# Altium schematic sheet CH240128.SchDoc
size A4; Organization: Altium Limited; Address1: L3, 12a Rodborough Rd; Address2: Frenchs Forest; Address3: NSW; Address4: Australia 2086
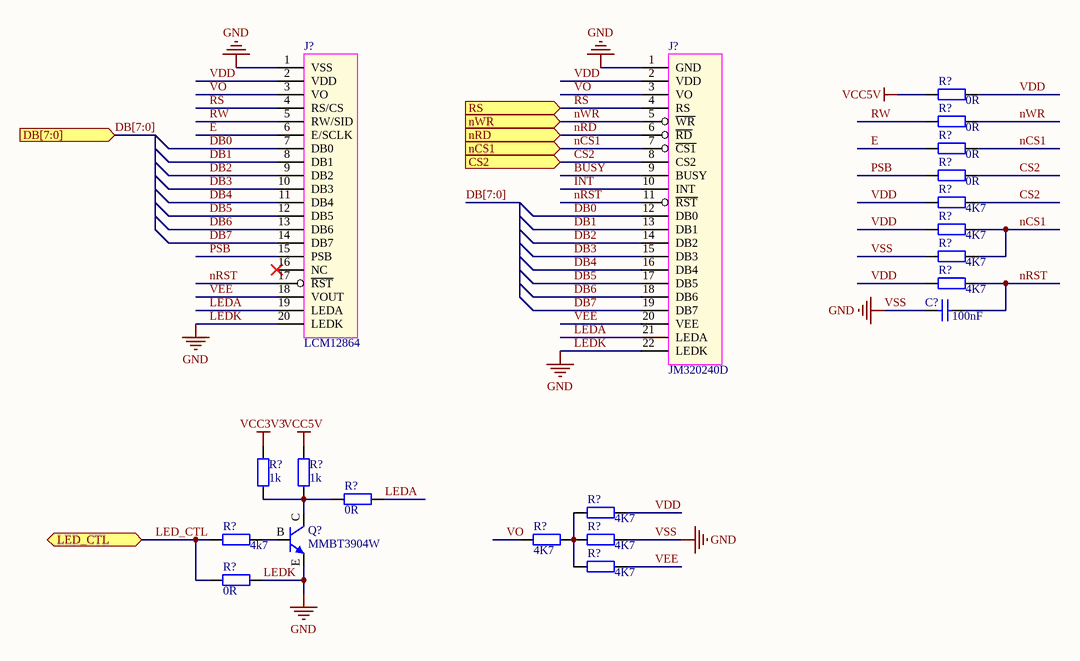
[diagram p0: CH240128.SchDoc]

## Parts
(Parts that share a designator on the sheet are numbered #1, #2 ... from top to bottom, then left to right.)
C?  value 100nF  [R0402]  (hidden comment: CAP_04)
J?#1  LCM12864
J?#2  JM320240D
Q?  MMBT3904W  [SOT_23]
R?#1  value 0R  [R0402]  (hidden comment: RES_04)
R?#2  value 0R  [R0402]  (hidden comment: RES_04)
R?#3  value 0R  [R0402]  (hidden comment: RES_04)
R?#4  value 0R  [R0402]  (hidden comment: RES_04)
R?#5  value 4K7  [R0402]  (hidden comment: RES_04)
R?#6  value 4K7  [R0402]  (hidden comment: RES_04)
R?#7  value 4K7  [R0402]  (hidden comment: RES_04)
R?#8  value 4K7  [R0402]  (hidden comment: RES_04)
R?#9  value 1k  [R0402]  (hidden comment: RES_04)
R?#10  value 1k  [R0402]  (hidden comment: RES_04)
R?#11  value 0R  [R0402]  (hidden comment: RES_04)
R?#12  value 4K7  [R0402]  (hidden comment: RES_04)
R?#13  value 4k7  [R0402]  (hidden comment: RES_04)
R?#14  value 4K7  [R0402]  (hidden comment: RES_04)
R?#15  value 4K7  [R0402]  (hidden comment: RES_04)
R?#16  value 4K7  [R0402]  (hidden comment: RES_04)
R?#17  value 0R  [R0402]  (hidden comment: RES_04)

## Ports
CS2 (in), DB[7:0] (in), LED_CTL, nCS1 (in), nRD (in), nWR (in), RS (in)

## Nets
LEDK: C?.1 J?#1.1(VSS) J?#1.20(LEDK) J?#2.1(GND) J?#2.22(LEDK) Q?.E R?#7.1 R?#15.2 R?#17.2  [also labelled GND, VSS]
VCC3V3: R?#9.1
VCC5V: R?#1.1 R?#10.1
BUSY: J?#2.9(BUSY)
CS2: J?#2.8(CS2) R?#4.2 R?#5.2 ; port CS2
DB0: J?#1.7(DB0) J?#2.12(DB0)
DB1: J?#1.8(DB1) J?#2.13(DB1)
DB2: J?#1.9(DB2) J?#2.14(DB2)
DB3: J?#1.10(DB3) J?#2.15(DB3)
DB4: J?#1.11(DB4) J?#2.16(DB4)
DB5: J?#1.12(DB5) J?#2.17(DB5)
DB6: J?#1.13(DB6) J?#2.18(DB6)
DB7: J?#1.14(DB7) J?#2.19(DB7)
E: J?#1.6(E/SCLK) R?#3.1
INT: J?#2.10(INT)
LED_CTL: R?#13.1 R?#17.1 ; port LED_CTL
LEDA: J?#1.19(LEDA) J?#2.21(LEDA) R?#11.2
nCS1: J?#2.7(~{CS1}) R?#3.2 R?#6.2 R?#7.2 ; port nCS1
nRD: J?#2.6(~{RD}) ; port nRD
nRST: C?.2 J?#1.17(~{RST}) J?#2.11(~{RST}) R?#8.2
nWR: J?#2.5(~{WR}) R?#2.2 ; port nWR
PSB: J?#1.15(PSB) R?#4.1
RS: J?#1.4(RS/CS) J?#2.4(RS) ; port RS
RW: J?#1.5(RW/SID) R?#2.1
VDD: J?#1.2(VDD) J?#2.2(VDD) R?#1.2 R?#5.1 R?#6.1 R?#8.1 R?#12.2
VEE: J?#1.18(VOUT) J?#2.20(VEE) R?#16.2
VO: J?#1.3(VO) J?#2.3(VO) R?#14.1
NetQ?_B: Q?.B R?#13.2
NetQ?_C: Q?.C R?#9.2 R?#10.2 R?#11.1
NetR?#12_1: R?#12.1 R?#14.2 R?#15.1 R?#16.1

Not connected (* = marked no-connect by the designer): J?#1 16(NC)*

## Buses and harness runs
bus DB[7:0]
bus DB[7:0] = port DB[7:0]

## Notes on the sheet
- Title
- Size:
- Date:
- A4
- Number:
- Time:
- Revision:
- Sheet
- of
- File:

## Library data of the parts
J?#1 = LCM12864: ST7920/LCM12864带中文字库
J?#2 = JM320240D: 320x240 RA8806 俊显电子
Q? = MMBT3904TT1G
R?#1-R?#17 = RES_04: 0402电阻